# Altium schematic sheet Antennas.SchDoc
size 594 x 420 mm; SheetNumber: 3; PageSetup: Record=PageOptions|CenterHorizontal=False|CenterVertical=False|PrintScale=0.43|XCorrection=0.00|YCorrection=0.00|PrintKind=1|BorderSize=5000000|LeftOffset=0|BottomOffset=0|Orientation=2|PaperLength=5940|PaperWidth=4200|Scale=100|PaperSource=7|PrintQuality=-4|MediaType=1|DitherType=10|PaperKind=Personal. 1: 215,9 x 279,4 mm|PrintScaleMode=0
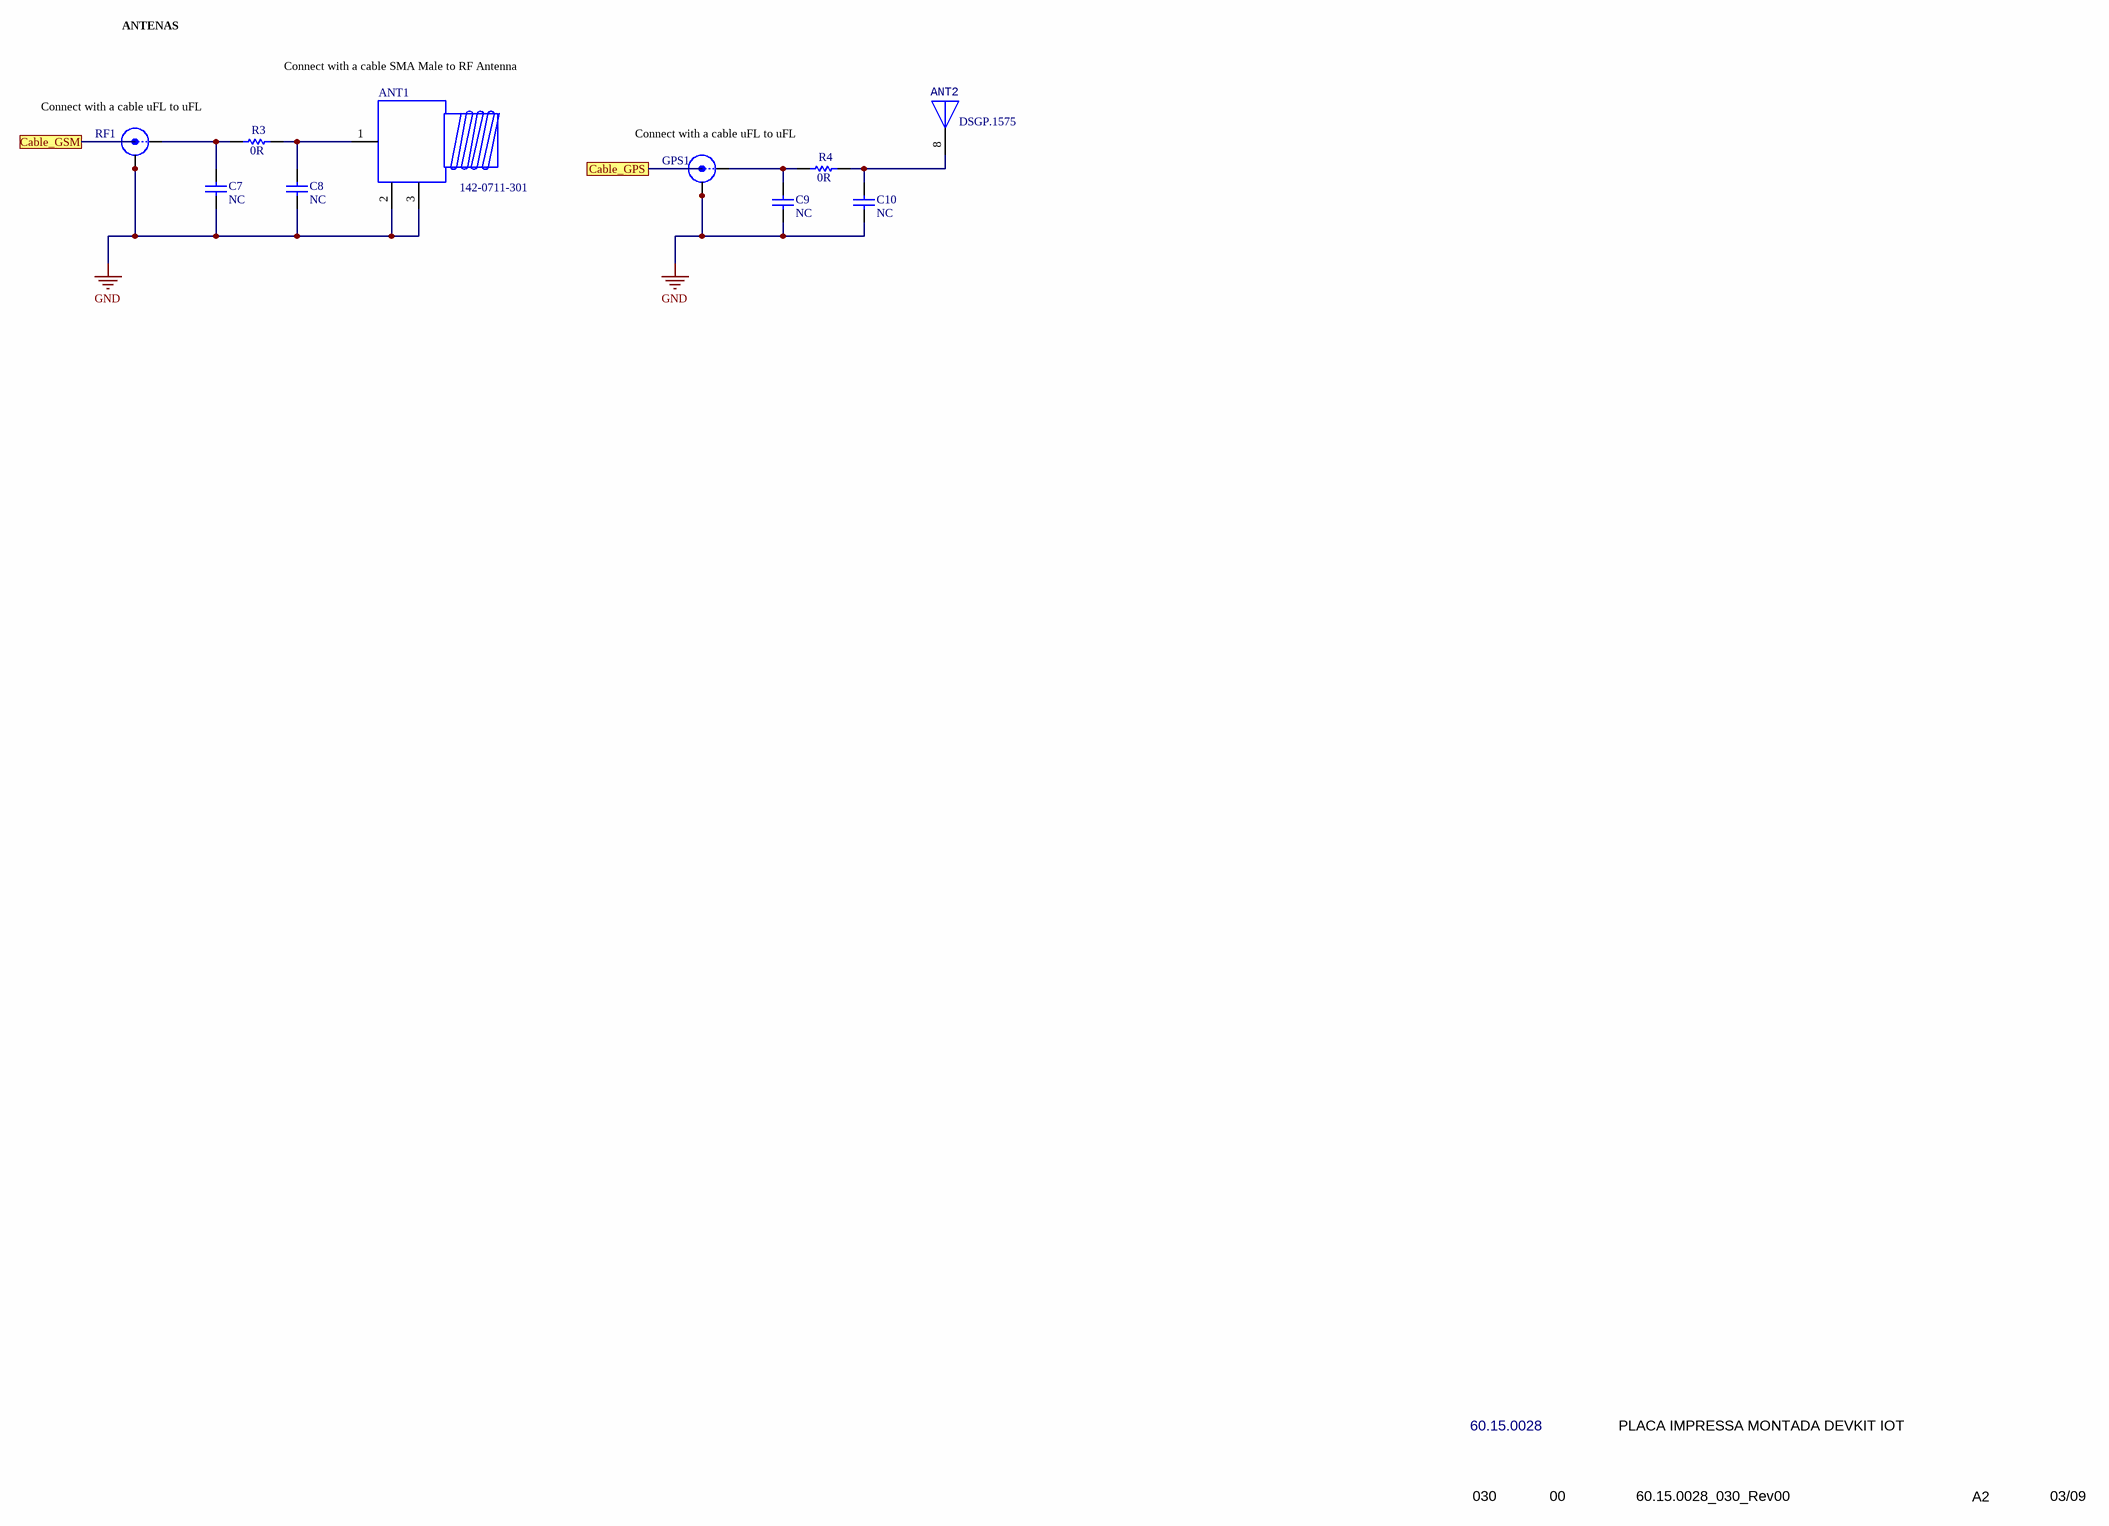
[diagram p0: Antennas.SchDoc]

## Parts
ANT1  value 142-0711-301  [28.21.0036]  (hidden comment: 28.21.0036)
ANT2  50.42.0045  [50.42.0045]  (value not drawn)
C7  value NC  [0603-CAP-NA]  (hidden comment: 0603-CAP-NA)
C8  value NC  [0603-CAP-NA]  (hidden comment: 0603-CAP-NA)
C9  value NC  [0603-CAP-NA]  (hidden comment: 0603-CAP-NA)
C10  value NC  [0603-CAP-NA]  (hidden comment: 0603-CAP-NA)
GPS1  28.20.0019  [28.20.0019]  (value not drawn)
R3  value 0R  [66.24.1337]  (hidden comment: 66.24.1337)
R4  value 0R  [66.24.1337]  (hidden comment: 66.24.1337)
RF1  28.20.0019  [28.20.0019]  (value not drawn)

## Ports
Cable_GPS, Cable_GSM

## Nets
GND: ANT1.2 ANT1.3 C7.1 C8.1 C9.1 C10.1 GPS1.2(GND) GPS1.3(GND) RF1.2(GND) RF1.3(GND)
NetANT1_1: ANT1.1 C8.2 R3.2
NetANT2_8: ANT2.8 C10.2 R4.2
NetC7_2: C7.2 R3.1 RF1.1(SIG)
NetC9_2: C9.2 GPS1.1(SIG) R4.1

## Notes on the sheet
- ANTENAS
- Connect with a cable SMA Male to RF Antenna
- Connect with a cable uFL to uFL
- 60.15.0028
- PLACA IMPRESSA MONTADA DEVKIT IOT
- 030
- 00
- 60.15.0028_030_Rev00
- A2
- 03/09
- 1
- 2
- 3
- 4
- 5
- 6
- 7
- 8
- A
- B
- C
- D
- E
- F
- G
- H
- DOCUMENTO DE ENGENHARIA DE PRODUTO
- DOCUMENT OF PRODUCT ENGINEERING
- CÓDIGO / CODE
- DESCRIÇÃO / DESCRIPTION
- DOC
- REV
- ARQUIVO / FILE
- FORM./SIZE
- FOLHA / PAGE
- (in symbol 50.42.0045) DSGP.1575

## Library data of the parts
ANT1 = 28.21.0036: CONECTOR SMA JACK R/A 50 OHM SMD
ANT2 = 50.42.0045: ANTENA CERAMICA SMT PARA GPSL1
C7-C10 = 0603-CAP-NA: CAPACITOR ABERTO
GPS1 RF1 = 28.20.0019: CONECTOR MICRO COAXIAL 50 OHM SMD
R3 R4 = 66.24.1337: RESISTOR THICK FILM 0,1W 0 OHMS SMD 0603